# Altium schematic sheet [10] - DEPLOYMENT SWITCHES AND RBF.SchDoc
size A4; DocumentNumber: 10; SheetNumber: 10; SheetTotal: 12
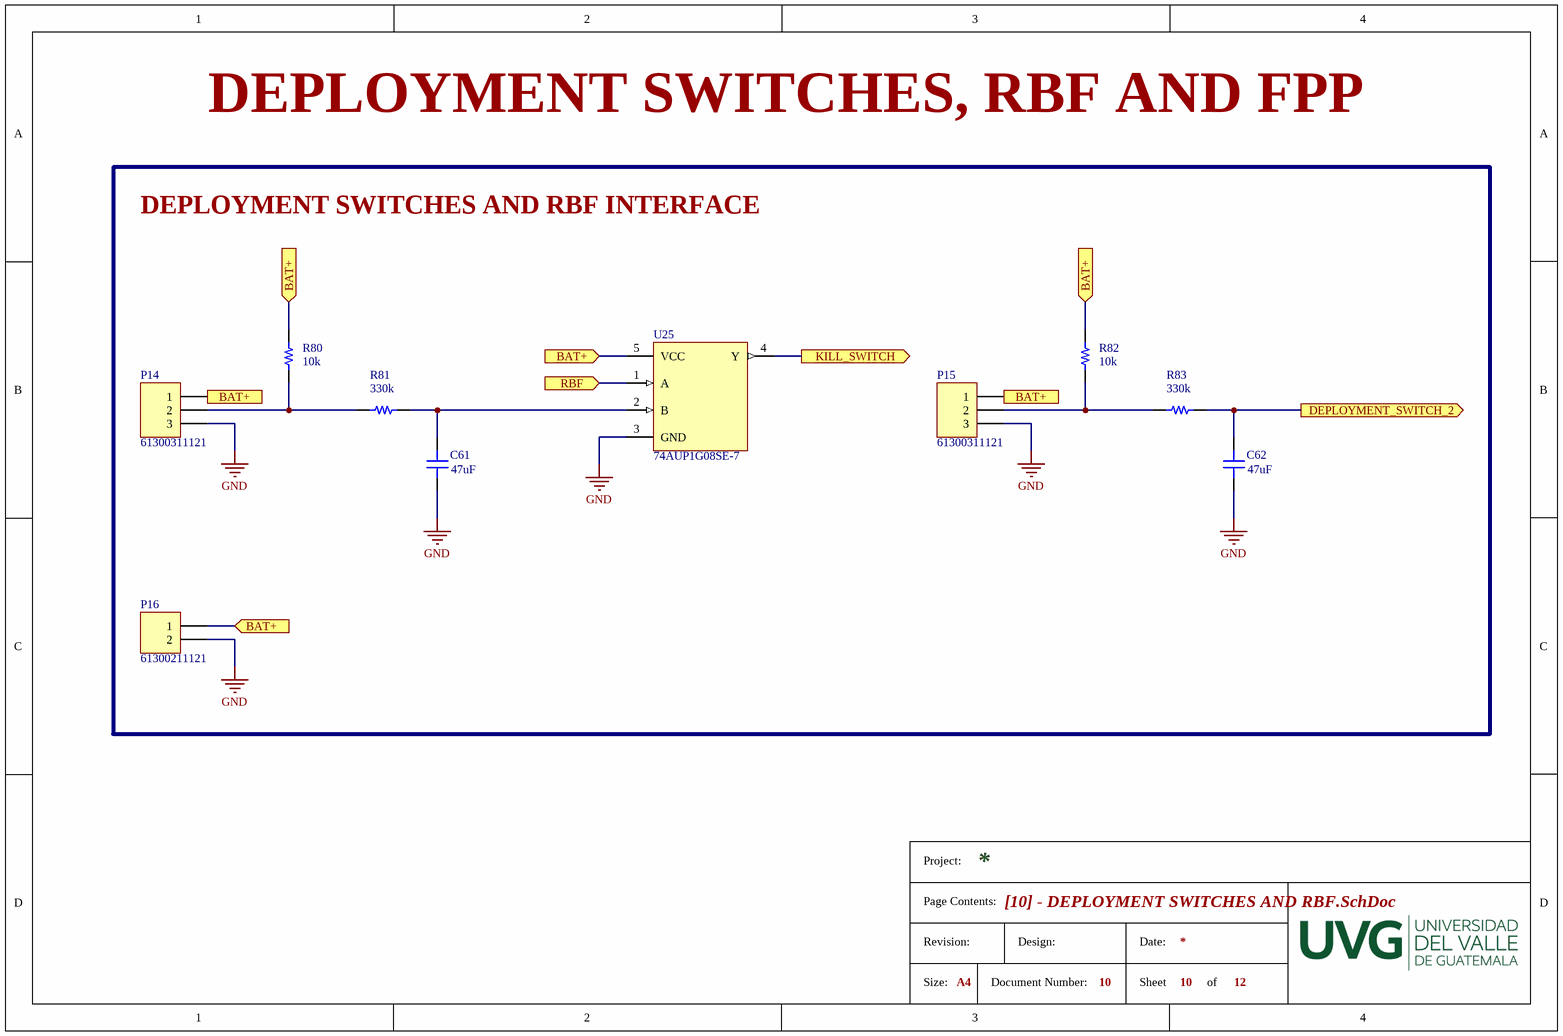
[diagram p0: [10] - DEPLOYMENT SWITCHES AND RBF.SchDoc]

## Parts
C61  Capacitance: 47uF  [CAP 0603/1608]  (hidden comment: GRM188R60E476ME15D)
C62  Capacitance: 47uF  [CAP 0603/1608]  (hidden comment: GRM188R60E476ME15D)
P14  61300311121  [61300311121]
P15  61300311121  [61300311121]
P16  61300211121  [61300211121]
R80  Resistance: 10k  [RES 0603/1608]  (hidden comment: RNCP0603FTD10K0)
R81  CRGCQ0603F330K  [RES 0603/1608]  (value not drawn)
R82  Resistance: 10k  [RES 0603/1608]  (hidden comment: RNCP0603FTD10K0)
R83  CRGCQ0603F330K  [RES 0603/1608]  (value not drawn)
U25  74AUP1G08SE-7  [SOT353-5]

## Ports
BAT+ (in), DEPLOYMENT_SWITCH_2 (out), KILL_SWITCH (out), RBF (in)

## Nets
GND: C61.1 C62.1 P14.3 P15.3 P16.2 U25.3(GND)
BAT+: P14.1 P15.1 P16.1 R80.2 R82.2 U25.5(VCC) ; port BAT+
DEPLOYMENT_SWITCH_2: C62.2 R83.2 ; port DEPLOYMENT_SWITCH_2
KILL_SWITCH: U25.4(Y) ; port KILL_SWITCH
RBF: U25.1(A) ; port RBF
NetC61_2: C61.2 R81.2 U25.2(B)
NetP14_2: P14.2 R80.1 R81.1
NetP15_2: P15.2 R82.1 R83.1

## Notes on the sheet
- DEPLOYMENT SWITCHES, RBF AND FPP
- DEPLOYMENT SWITCHES AND RBF INTERFACE
- (near R81) 330k
- (near R83) 330k
- Project:
- Page Contents:
- Size:
- Revision:
- A4
- Document Number:
- Design:
- Date:
- Sheet
- of

## Library data of the parts
C61 C62 = GRM188R60E476ME15D: CAP CER 47UF 2.5V X5R 0603; Manufacturer: Murata; Tolerance: 20%; Supplier 1: Digi-Key; Manufacturer Part Number: GRM188R60E476ME15D; Stock 1: 21402; Pricing 1: 1 = 0.50000, 10 = 0.35000, 100 = 0.23070, 500 = 0.17090, 1000 = 0.14527 (USD); RoHS: Yes; Mount: Surface Mount; Case/Package: 0603; Case Code (Metric): 1608; Case Code (Imperial): 0603; Min Operating Temperature: -55°C; Max Operating Temperature: 85°C; Packaging: Tape and Reel; Voltage Rating: 2.5V; Voltage Rating (DC): 2.5V; Dielectric: X5R; Length: 0.063inch; Width: 0.031inch; Thickness: 0.039inch; ComponentLink1URL: http://search.murata.co.jp/Ceramy/image/img/A01X/G101/ENG/GRM188R60E476ME15-01.pdf?src-supplier=Digi-Key; ComponentLink1Description: http://search.murata.co.jp/Ceramy/image/img/A01X/G101/ENG/GRM188R60E476ME15-01.pdf?src-supplier=Digi-Key; ComponentLink2URL: http://search.murata.co.jp/Ceramy/image/img/A01X/partnumbering_e_01.pdf?src-supplier=Digi-Key; ComponentLink2Description: http://search.murata.co.jp/Ceramy/image/img/A01X/partnumbering_e_01.pdf?src-supplier=Digi-Key; Supplier Part Number 1: 490-13245-1-ND
P14 P15 = 61300311121: CONN HEADER 3 POS 2.54; Manufacturer: Wurth Electronics; Number of Positions: 3; Gender: Male; Connector Type: Male Pin; Pitch: 0.1inch; Supplier 1: Digi-Key; Manufacturer Part Number: 61300311121; Stock 1: 175744; Mount: Through Hole; Contact Plating: Gold; Contact Material: Copper; Colour: Black; Number of Rows: 1; Packaging: Bulk; Termination: Solder; Number of Contacts: 3; Contact Mating Length: 0.236inch; REACH SVHC: Unknown; Lead Free: Lead Free; Supplier Part Number 1: 732-5316-ND
P16 = 61300211121: CONN HEADER 2 POS 2.54; Manufacturer: Wurth Electronics; Current Rating: 3A; Voltage Rating: 250V; Number of Positions: 2; Gender: Male; Connector Type: Male Pin; Pitch: 0.1inch; Supplier 1: Digi-Key; Manufacturer Part Number: 61300211121; Stock 1: 98753; Pricing 1: 1=0.13, 10=0.106, 25=0.088, 50=0.074, 100=0.067, 1000=0.061 (USD); Mount: Through Hole; Contact Plating: Gold; Housing Material: PBT; Contact Material: Copper,Copper Alloy; Colour: Black; Min Operating Temperature: -40°C; Max Operating Temperature: 125°C; Number of Rows: 1; Contact Gender: Male; Packaging: Bulk; Termination: Through Hole; Number of Contacts: 2; Contact Mating Length: 0.236inch; REACH SVHC: Unknown; Lead Free: Lead Free; ComponentLink1URL: https://datasheet.ciiva.com/13619/6130xx11121-48870-13619345.pdf; ComponentLink1Description: https://datasheet.ciiva.com/13619/6130xx11121-48870-13619345.pdf; Supplier Part Number 1: 732-5315-ND
R80 R82 = RNCP0603FTD10K0: RES SMD 10K OHM 1% 1/8W 0603; Manufacturer: Stackpole Electronics; Max Power Dissipation: 125mW; Temperature Coefficient: 100ppm/°C; Supplier 1: Digi-Key; Manufacturer Part Number: RNCP0603FTD10K0; Stock 1: 579582; Pricing 1: 1 = 0.10000, 10 = 0.06700, 100 = 0.02730, 1000 = 0.01224, 2500 = 0.01063 (USD); RoHS: Yes; Mount: Surface Mount; Case/Package: 0603; Case Code (Metric): 1608; Case Code (Imperial): 0603; Contact Plating: Tin; Min Operating Temperature: -55°C; Max Operating Temperature: 155°C; Packaging: Tape and Reel; Tolerance: 1%; Composition: Thin Film; Number of Terminations: 2; Features: Moisture Resistant; Length: 0.059inch; Height: 0.02inch; Width: 0.031inch; Radiation Hardening: No; Lead Free: Lead Free; ComponentLink1URL: https://www.seielect.com/Catalog/SEI-rncp.pdf?src-supplier=Avnet; ComponentLink1Description: https://www.seielect.com/Catalog/SEI-rncp.pdf?src-supplier=Avnet; ComponentLink2URL: https://www.seielect.com/catalog/SEI-Packaging.pdf?src-supplier=Digi-Key; ComponentLink2Description: https://www.seielect.com/catalog/SEI-Packaging.pdf?src-supplier=Digi-Key; ComponentLink3URL: https://www.seielect.com/Catalog/SEI-rncp.pdf?src-supplier=Digi-Key; ComponentLink3Description: https://www.seielect.com/Catalog/SEI-rncp.pdf?src-supplier=Digi-Key; Supplier Part Number 1: RNCP0603FTD10K0CT-ND
R81 R83 = CRGCQ0603F330K: RES SMD 330K OHM 1% 1/10W 0603; Manufacturer: TE Connectivity; Supplier 1: Digi-Key; Manufacturer Part Number: CRGCQ0603F330K; Stock 1: 91633; Pricing 1: 1 = 0.10000, 10 = 0.03100, 100 = 0.01260, 1000 = 0.00568, 2500 = 0.00493 (USD); RoHS: No; ComponentLink1URL: https://www.te.com/commerce/DocumentDelivery/DDEController?Action=srchrtrv&DocNm=1773204-3&DocType=DS&DocLang=English&src-supplier=Digi-Key; ComponentLink1Description: https://www.te.com/commerce/DocumentDelivery/DDEController?Action=srchrtrv&DocNm=1773204-3&DocType=DS&DocLang=English&src-supplier=Digi-Key; ComponentLink2URL: https://www.te.com/commerce/DocumentDelivery/DDEController?Action=srchrtrv&amp;DocNm=1773204-3&amp;DocType=DS&amp;DocLang=English&src-supplier=Digi-Key; ComponentLink2Description: https://www.te.com/commerce/DocumentDelivery/DDEController?Action=srchrtrv&amp;DocNm=1773204-3&amp;DocType=DS&amp;DocLang=English&src-supplier=Digi-Key; Supplier Part Number 1: A129718CT-ND
U25 = 74AUP1G08SE-7: IC GATE AND 1CH 2-INP SOT-353; Manufacturer: Diodes; Min Supply Voltage: 800mV; Max Supply Voltage: 3.6V; Number of Inputs: 2; Propagation Delay: 6.2ns; Number of Outputs: 1; Quiescent Current: 500nA; High Level Output Current: 4mA; Supplier 1: Digi-Key; Manufacturer Part Number: 74AUP1G08SE-7; Stock 1: 896; Pricing 1: 1 = 0.43000, 10 = 0.37100, 100 = 0.27690, 500 = 0.21754, 1000 = 0.16810 (USD); RoHS: Yes; Mount: Surface Mount; Case/Package: SOT-353; Number of Pins: 5; Contact Plating: Tin; Min Operating Temperature: -40°C; Max Operating Temperature: 125°C; Logic Function: AND; Package Quantity: 3000; Packaging: Tape and Reel; Number of Circuits: 1; Low Level Output Current: 4mA; Number of Elements: 1; Radiation Hardening: No; REACH SVHC: No SVHC; Lead Free: Lead Free; ComponentLink1URL: https://datasheet.ciiva.com/12255/74aup1g08-219333-12255218.pdf?src-supplier=Mouser; ComponentLink1Description: https://datasheet.ciiva.com/12255/74aup1g08-219333-12255218.pdf?src-supplier=Mouser; ComponentLink2URL: https://datasheet.ciiva.com/15219/getdatasheetpartid-661118-15219698.pdf?src-supplier=Verical; ComponentLink2Description: https://datasheet.ciiva.com/15219/getdatasheetpartid-661118-15219698.pdf?src-supplier=Verical; ComponentLink3URL: https://datasheet.ciiva.com/6620/74aup1g08-6620571.pdf?src-supplier=Digi-Key; ComponentLink3Description: https://datasheet.ciiva.com/6620/74aup1g08-6620571.pdf?src-supplier=Digi-Key; ComponentLink4URL: https://datasheet.ciiva.com/6620/74aup1g08-6620573.pdf?src-supplier=Digi-Key; ComponentLink4Description: https://datasheet.ciiva.com/6620/74aup1g08-6620573.pdf?src-supplier=Digi-Key; ComponentLink5URL: https://datasheet.ciiva.com/6620/74aup1g08-6620575.pdf?src-supplier=Digi-Key; ComponentLink5Description: https://datasheet.ciiva.com/6620/74aup1g08-6620575.pdf?src-supplier=Digi-Key; Supplier Part Number 1: 74AUP1G08SE-7DICT-ND